# EAGLE design Wifi (EAGLE 6.1)
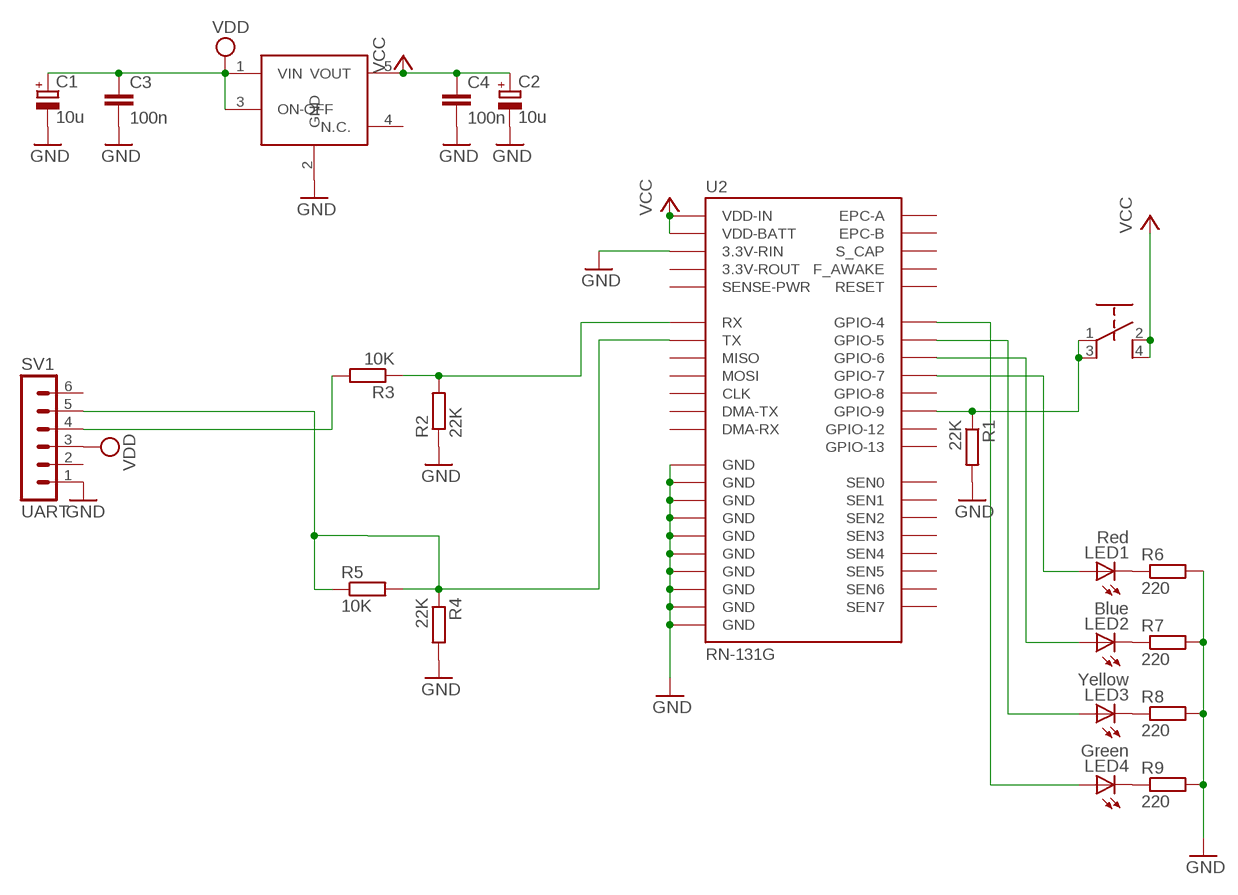
[diagram p0: schematic, sheet 1]

## Parts
C1  10u  CPOL-EUA/3216-18W  [A/3216-18W]
C2  10u  CPOL-EUA/3216-18W  [A/3216-18W]
C3  100n  C-EUC0805  [C0805]
C4  100n  C-EUC0805  [C0805]
LED1  Red  LED3MM  [LED3MM]
LED2  Blue  LED3MM  [LED3MM]
LED3  Yellow  LED3MM  [LED3MM]
LED4  Green  LED3MM  [LED3MM]
R1  22K  R-EU_R0805  [R0805]
R2  22K  R-EU_R0805  [R0805]
R3  10K  R-EU_R0805  [R0805]
R4  22K  R-EU_R0805  [R0805]
R5  10K  R-EU_R0805  [R0805]
R6  220  R-EU_R0805  [R0805]
R7  220  R-EU_R0805  [R0805]
R8  220  R-EU_R0805  [R0805]
R9  220  R-EU_R0805  [R0805]
S2  PUSHBUTTON  [PUSHBUTTON]
SV1  UART  MA06-1  [MA06-1]
U1  LP2985  [SOT23-5]
U2  RN-131G  [RN-131G]

## Nets
GND: C1.- C2.- C3.2 C4.2 R1.2 R2.1 R4.2 R6.2 R7.2 R8.2 R9.2 SV1.1 U1.2(GND) U2.P$18(3.3V-RIN) U2.P$19(GND) U2.P$36(GND) U2.P$37(GND) U2.P$38(GND) U2.P$39(GND) U2.P$40(GND) U2.P$41(GND) U2.P$42(GND) U2.P$43(GND) U2.P$44(GND)
N$1: R1.1 S2.1 S2.3 U2.P$24(GPIO-9)
N$2: R2.2 R3.1 U2.P$12(RX)
N$3: R4.1 R5.1 R5.2 SV1.5 U2.P$13(TX)
N$5: LED1.K(C) R6.1
N$6: R3.2 SV1.4
N$8: LED2.K(C) R7.1
N$9: LED3.K(C) R8.1
N$10: LED4.K(C) R9.1
N$12: LED1.A U2.P$26(GPIO-7)
N$13: LED2.A U2.P$27(GPIO-6)
N$14: LED3.A U2.P$28(GPIO-5)
N$15: LED4.A U2.P$29(GPIO-4)
VCC: C2.+ C4.1 S2.2 S2.4 U1.5(VOUT) U2.P$20(VDD-BATT) U2.P$21(VDD-IN)
VDD: C1.+ C3.1 SV1.3 U1.1(VIN) U1.3(ON-OFF)
Unconnected: SV1.2 SV1.6 U1.4(N.C.) U2.P$1(SEN6) U2.P$2(SEN4) U2.P$3(SEN5) U2.P$4(SEN7) U2.P$5(RESET) U2.P$6(EPC-A) U2.P$7(EPC-B) U2.P$8(S_CAP) U2.P$9(F_AWAKE) U2.P$10(GPIO-13) U2.P$11(GPIO-12) U2.P$14(MOSI) U2.P$15(CLK) U2.P$16(MISO) U2.P$17(3.3V-ROUT) U2.P$22(DMA-TX) U2.P$23(DMA-RX) U2.P$25(GPIO-8) U2.P$30(SEN1) U2.P$31(SEN2) U2.P$32(SEN3) U2.P$33(SENSE-PWR) U2.P$34(SEN0)

## Library data of the parts
C1 C2 = rcl:CPOL-EU: POLARIZED CAPACITOR, European symbol
C3 C4 = rcl:C-EU: CAPACITOR, European symbol
LED1-LED4 = led:LED: LED OSRAM: - CHIPLED LG R971, LG N971, LY N971, LG Q971, LY Q971, LO R971, LY R971 LH N974, LH R974 LS Q976, LO Q976, LY Q976 LO Q996 - Hyper CHIPLED LW Q18S LB Q993, LB Q99A, LB R99A - SideLED LS A670, LO A670, LY A670, LG A670, LP A670 LB A673, LV A673, LT A673, LW A673 LH A674 LY A675 LS A676, LA A676, LO A676, LY A676, LW A676 LS A679, LY A679, LG A679 - Hyper Micro SIDELED® LS Y876, LA Y876, LO Y876, LY Y876 LT Y87S - SmartLED LW L88C, LW L88S LB L89C, LB L89S, LG L890 LS L89K, LO L89K, LY L89K LS L896, LA L896, LO L896, LY L896 - TOPLED LS T670, LO T670, LY T670, LG T670, LP T670 LSG T670, LSP T670, LSY T670, LOP T670, LYG T670 LG T671, LOG T671, LSG T671 LB T673, LV T673, LT T673, LW T673 LH T674 LS T676, LA T676, LO T676, LY T676, LB T676, LH T676, LSB T676, LW T676 LB T67C, LV T67C, LT T67C, LS T67K, LO T67K, LY T67K, LW E67C LS E67B, LA E67B, LO E67B, LY E67B, LB E67C, LV E67C, LT E67C LW T67C LS T679, LY T679, LG T679 LS T770, LO T770, LY T770, LG T770, LP T770 LB T773, LV T773, LT T773, LW T773 LH T774 LS E675, LA E675, LY E675, LS T675 LS T776, LA T776, LO T776, LY T776, LB T776 LHGB T686 LT T68C, LB T68C - Hyper Mini TOPLED® LB M676 - Mini TOPLED Santana® LG M470 LS M47K, LO M47K, LY M47K Source: http://www.osram.convergy.de LUXEON: - LUMILED® LXK2-PW12-R00, LXK2-PW12-S00, LXK2-PW14-U00, LXK2-PW14-V00 LXK2-PM12-R00, LXK2-PM12-S00, LXK2-PM14-U00 LXK2-PE12-Q00, LXK2-PE12-R00, LXK2-PE12-S00, LXK2-PE14-T00, LXK2-PE14-U00 LXK2-PB12-K00, LXK2-PB12-L00, LXK2-PB12-M00, LXK2-PB14-N00, LXK2-PB14-P00, LXK2-PB14-Q00 LXK2-PR12-L00, LXK2-PR12-M00, LXK2-PR14-Q00, LXK2-PR14-R00 LXK2-PD12-Q00, LXK2-PD12-R00, LXK2-PD12-S00 LXK2-PH12-R00, LXK2-PH12-S00 LXK2-PL12-P00, LXK2-PL12-Q00, LXK2-PL12-R00 Source: www.luxeon.com KINGBRIGHT: KA-3528ASYC Source: www.kingbright.com
R1-R9 = rcl:R-EU_: RESISTOR, European symbol
S2 = pushbutton:PUSHBUTTON
SV1 = con-lstb:MA06-1: PIN HEADER
U1 = LP2985:LP2985
U2 = SparkFun:RN-131G: Roving Netowrks WiFLy GSX Module

## Net classes
0 default: width 0.254 mm, drill 0.254 mm, clearance 0.254 mm
2 gnd: width 0.305 mm, drill 0.508 mm, clearance 0.203 mm

## Board
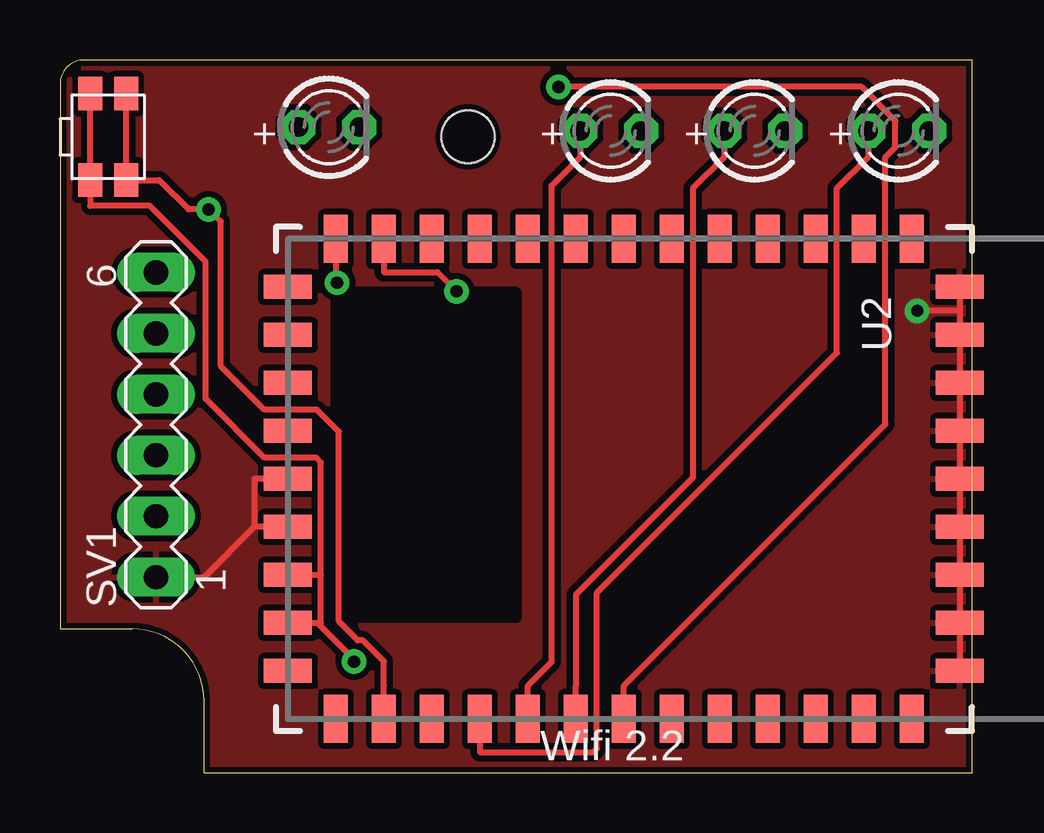
[diagram p1: board, top side]
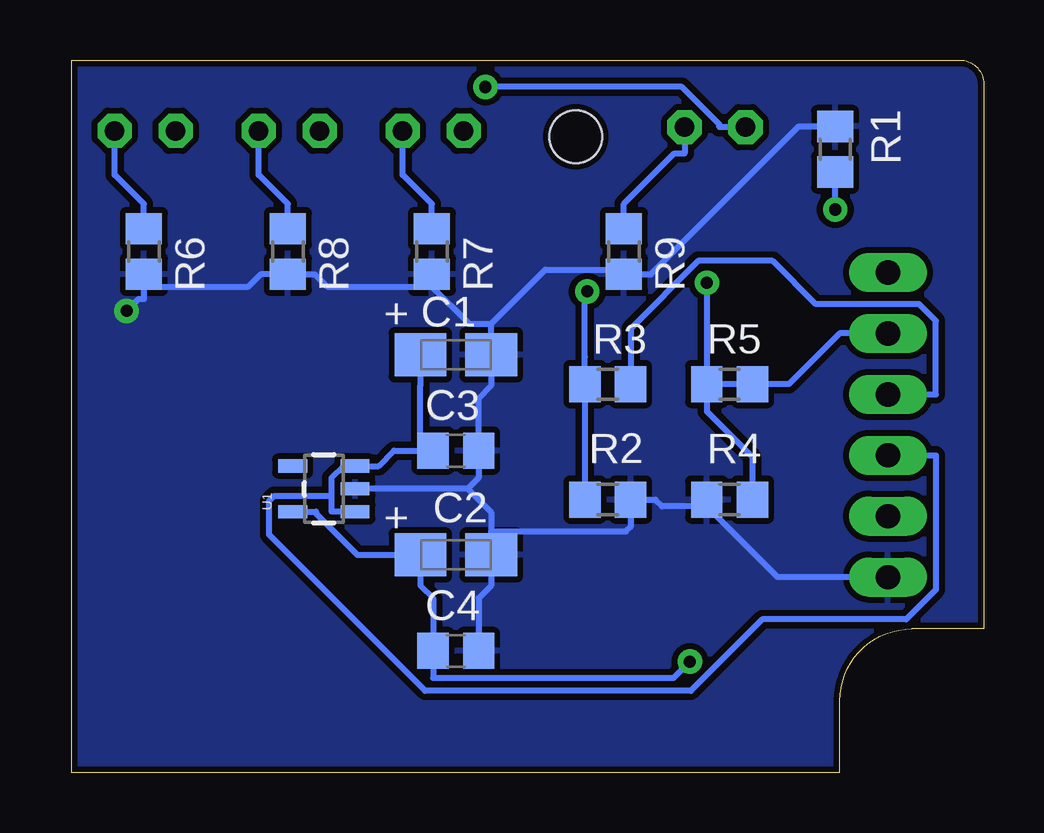
[diagram p2: board, bottom side, seen from below]

Size 38 x 29.7 mm. Coordinates in mm from the lower left corner, seen from the top.
Outline: 6,0 38,0 38,29.7 1,29.7 arc90 0,28.7 0,6 3,6 arc-90 6,3 6,0
Copper layers (1*16): Top 0.035mm / dielectric 1.5mm / Bottom 0.035mm
Design rules: minimum track width 8mil, minimum drill 20mil, track to track 8mil, track to pad 8mil, pad to pad 8mil, via to via 8mil, smd to smd 8mil, copper to edge 10mil, drill to drill 8mil, minimum pad ring 12mil, minimum via ring 10mil, stop-mask expansion 4mil, vias tented up to drill 25mil, thermal gap 10mil
Holes 2.2 mm at 17,26.5
tRestrict: area 11.5,6.5 to 19,20

### Footprints (pad centres in the part's own frame; a part is rotated, then mirrored left to right if it is on the bottom)
A/3216-18W = smd 2.15 x 1.8: + 1.475,0; - -1.475,0
C0805 = smd 1.3 x 1.5: 1 -0.95,0; 2 0.95,0
LED3MM = drill 0.813 octagon: A -1.27,0; K 1.27,0
R0805 = smd 1.3 x 1.5: 1 -0.95,0; 2 0.95,0
PUSHBUTTON = smd 1.4 x 1: 1 -1.8,0.75; 2 -1.8,-0.75; 3 1.8,0.75; 4 1.8,-0.75
MA06-1 = drill 1.016 long: 1 -6.35,0; 2 -3.81,0; 3 -1.27,0; 4 1.27,0; 5 3.81,0; 6 6.35,0
SOT23-5 = smd 0.55 x 1.2: 1 -0.95,-1.3; 2 0,-1.3; 3 0.95,-1.3; 4 0.95,1.3; 5 -0.95,1.3
RN-131G = smd 2 x 1: P$1 -10,11; P$2 -10,9; P$3 -10,7; P$4 -10,5; P$5 -10,3; P$6 -10,1; P$7 -10,-1; P$8 -10,-3; P$9 -10,-5; P$10 -10,-7; P$11 -10,-9; P$12 -10,-11; P$13 -10,-13; P$23 10,-13; P$24 10,-11; P$25 10,-9; P$26 10,-7; P$27 10,-5; P$28 10,-3; P$29 10,-1; P$30 10,1; P$31 10,3; P$32 10,5; P$33 10,7; P$34 10,9; P$35 10,11 | smd 1 x 2: P$14 -8,-15; P$15 -6,-15; P$16 -4,-15; P$17 -2,-15; P$18 0,-15; P$19 2,-15; P$20 4,-15; P$21 6,-15; P$22 8,-15; P$36 8,13; P$37 6,13; P$38 4,13; P$39 2,13; P$40 0,13; P$41 -2,13; P$42 -4,13; P$43 -6,13; P$44 -8,13

### Placement (x,y rotation side)
C1  22,17.42 180 bottom
C2  22,9.08 180 bottom
C3  22,13.42 0 bottom
C4  22,5.08 0 bottom
LED1  34.95,26.75 0 top
LED2  22.95,26.75 0 top
LED3  28.95,26.75 0 top
LED4  11.2,26.9 0 top
R1  6.19,25.98 90 bottom
R2  15.67,11.38 180 bottom
R3  15.67,16.19 0 bottom
R4  10.59,11.38 180 bottom
R5  10.59,16.19 180 bottom
R6  35,21.72 270 bottom
R7  23,21.72 270 bottom
R8  29,21.72 270 bottom
R9  15,21.72 270 bottom
S2  2,26.5 270 top
SV1  4,14.5 90 top
U1  27.5,11.83 90 bottom
U2  24.49,12.25 270 top

### Tracks (layer width: path | path; a pad name or v marks a point on that pad's centre or on a via)
GND  (via drill 0.51 pad 1.02)
  Top 0.254: 8.11,10.25 8.1,10.25 6.01,8.15 SV1.1 | U2.P$19 8.11,10.25 | 8.11,10.25 8.11,12.25 U2.P$18 | 37.49,19.25 v35.72,19.25 | 37.49,19.25 U2.P$43 U2.P$42 U2.P$41 U2.P$40 U2.P$39 U2.P$38 U2.P$37 U2.P$36 | U2.P$44 37.49,19.25
  Bottom 0.254: 21.51,11.83 U1.2 | 21.51,11.83 21.05,12.29 21.05,12.33 C3.2 21.05,15.61 20.52,16.14 C1.- 20.52,18.7 | 21.51,11.83 20.52,10.85 20.52,10.06 | R1.2 7.71,26.93 13.87,20.77 R9.2 15.19,20.96 18.27,20.96 20.52,18.7 | C4.2 21.05,7.27 20.52,7.8 C2.- 20.52,10.06 | 23,20.25 21.45,18.7 20.52,18.7 | 23,20.25 27.35,20.25 27.87,20.77 R8.2 30.13,20.77 30.65,20.25 35,20.25 | 35,20.25 35,19.74 35.22,19.74 v35.72,19.25 | R6.2 35,20.25 | 20.52,10.06 14.91,10.06 14.72,10.25 R2.1 13.69,11.38 13.41,11.1 11.54,11.1 | SV1.1 8.59,8.15 11.54,11.1 | R4.2 11.54,11.1 | R7.2 23,20.25
  pour Bottom (isolate 0.254): 0,0 0,30 38,30 38,0
  pour Top (isolate 0.254): 0,0 0,30 38,30 38,0
N$1  (via drill 0.51 pad 1.02)
  Top 0.254: U2.P$24 13.49,3.63 13.49,4.65 12.62,5.52 12.4,5.52 11.62,6.31 11.62,14.21 10.7,15.13 8.52,15.13 6.7,16.95 6.7,22.96 v6.19,23.47 5.36,23.47 4.13,24.7 3.19,24.7 | 3.19,24.7 2.75,25.14 S2.1 | S2.3 3.19,24.7
  Bottom 0.254: v6.19,23.47 R1.1
N$2  (via drill 0.51 pad 1.02)
  Top 0.254: v16.52,20.06 15.72,20.86 13.49,20.86 U2.P$12
  Bottom 0.254: v16.52,20.06 16.62,19.96 16.62,17.32 R3.1 R2.2
N$3  (via drill 0.51 pad 1.02)
  Top 0.254: U2.P$13 11.49,20.86 11.54,20.82 v11.54,20.42
  Bottom 0.254: SV1.5 6.01,18.31 8.13,16.19 R5.1 R5.2 | R5.2 11.54,15.06 9.64,13.16 R4.1 | v11.54,20.42 R5.2
N$5
  Bottom 0.254: R6.1 35,23.7 36.22,24.92 LED1.K
N$6
  Bottom 0.254: SV1.4 1.99,15.77 1.99,18.83 2.7,19.53 7,19.53 8.8,21.33 11.9,21.33 14.72,18.51 R3.2
N$8
  Bottom 0.254: R7.1 23,23.7 24.22,24.92 LED2.K
N$9
  Bottom 0.254: R8.1 29,23.7 30.22,24.92 LED3.K
N$10
  Bottom 0.254: LED4.K 12.47,25.81 12.89,25.81 15,23.7 R9.1
N$12
  Top 0.254: LED1.A 33.68,25.66 32.37,24.36 32.37,17.49 22.37,7.49 22.37,1.02 22.22,0.86 17.49,0.86 U2.P$26
N$13
  Top 0.254: LED2.A 21.68,25.66 20.49,24.47 20.49,4.62 19.49,3.63 U2.P$27
N$14
  Top 0.254: U2.P$28 21.49,3.63 21.49,7.42 26.37,12.3 26.37,24.36 27.68,25.66 LED3.A
N$15  (via drill 0.51 pad 1.02)
  Top 0.254: U2.P$29 23.49,3.63 34.4,14.53 34.4,25.66 34.81,26.07 34.81,27.16 33.4,28.58 v20.77,28.58
  Bottom 0.254: v20.77,28.58 12.59,28.58 11.02,27.01 11.02,26.9 LED4.A
VCC  (via drill 0.51 pad 1.02)
  Top 0.254: 10.73,6.25 12.25,4.72 v12.25,4.63 | 10.73,6.25 10.87,6.25 10.87,8.25 | 10.73,6.25 10.28,6.25 10.18,6.25 U2.P$21 | 10.87,8.25 10.87,12.92 10.67,13.13 8.52,13.13 6.06,15.58 6.06,21.3 3.74,23.62 1.25,23.62 S2.4 1.25,25.24 1.25,25.78 S2.2 | 10.87,8.25 10.75,8.25 U2.P$20
  Bottom 0.254: v12.25,4.63 12.93,3.95 22.95,3.95 C4.1 22.95,7.27 23.48,7.8 C2.+ 26.1,9.08 27.82,10.8 27.82,10.88 U1.5
VDD
  Bottom 0.254: 27.18,11.54 29.57,11.54 29.78,11.33 29.78,9.92 23.28,3.42 12.21,3.42 9.23,6.39 3.23,6.39 1.99,7.63 1.99,13.23 SV1.3 | 23.48,13.42 C3.1 | 23.48,13.42 24.58,13.42 25.22,12.78 U1.3 26.45,12.78 26.69,12.78 27.18,12.29 27.18,11.54 | 23.48,13.42 23.48,16.14 C1.+ | 27.18,11.54 27.18,10.88 U1.1

### Text on the board
tPlace: + | + | + | +
tNames: Wifi 2.2
bNames: + | +